# EAGLE design Lab Controller Board v09 (EAGLE 7.5.0)

## Sheet 1 of 2: LED Controller
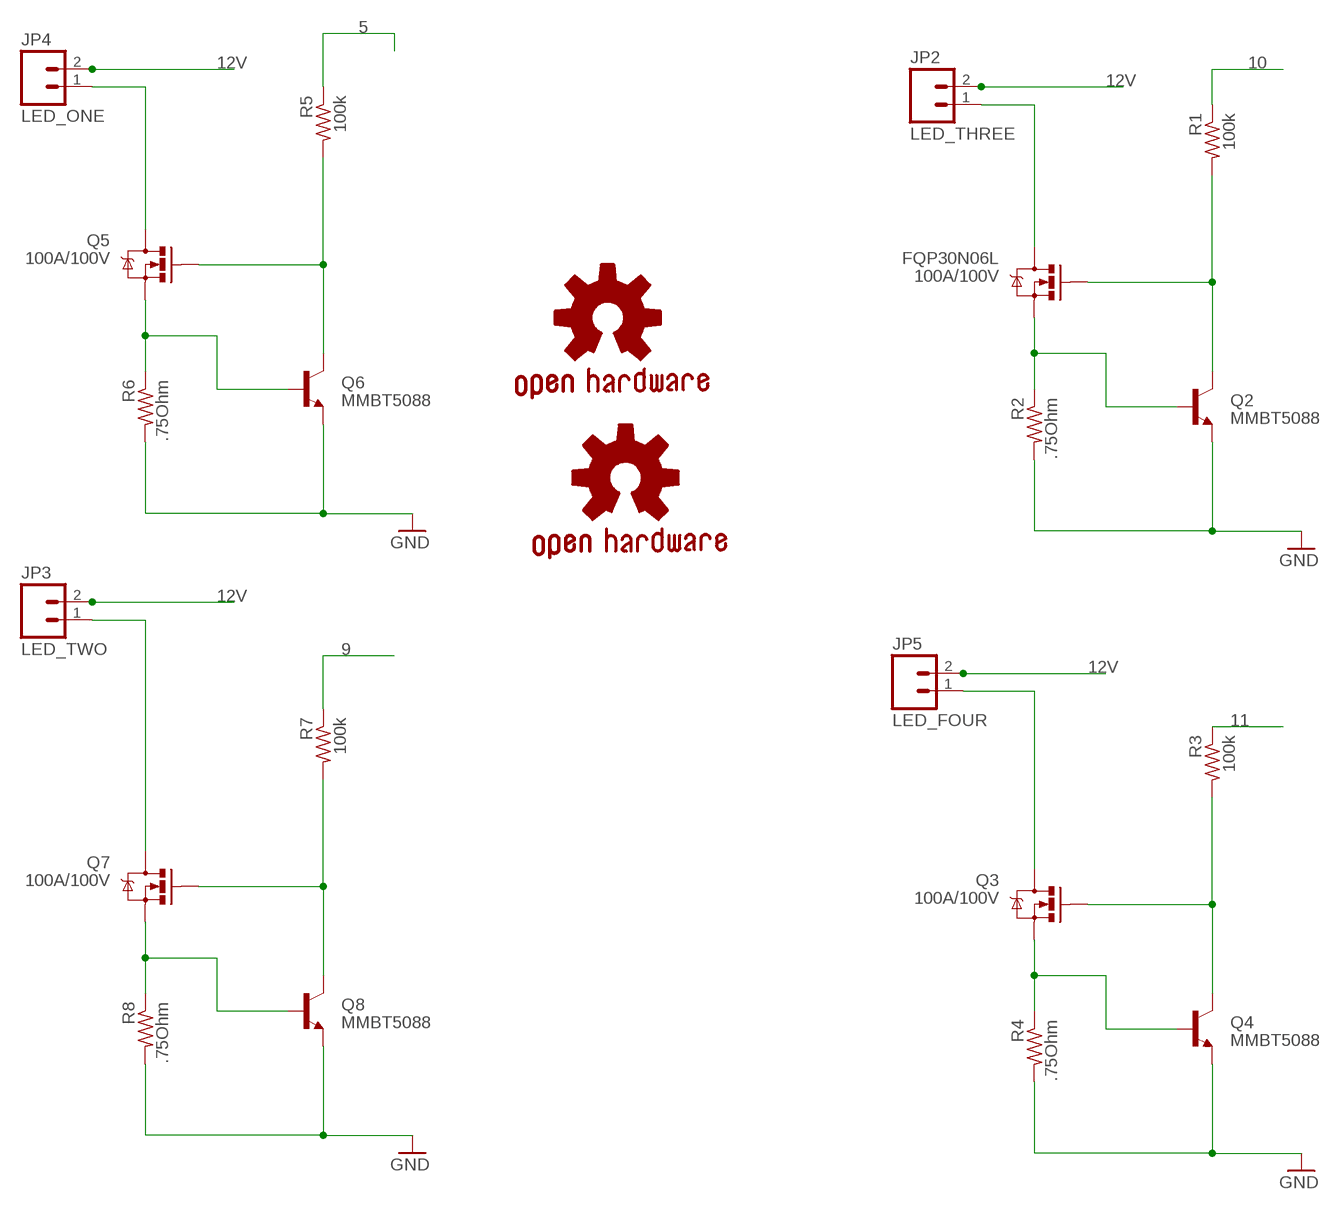
[diagram p0: schematic, sheet 1]

### Parts
FQP30N06L  100A/100V  MOSFET-NCHANNELPSMN7R0  [TO-263/D2PAK]
GOLD_ORB_SM1  OSHWLOGO_GOLD_ORB_MED  [OSHW1]
GOLD_ORB_SM2  OSHWLOGO_GOLD_ORB_SM  [OSHW2]
JP2  LED_THREE  M025MM  [SCREWTERMINAL-5MM-2]
JP3  LED_TWO  M025MM  [SCREWTERMINAL-5MM-2]
JP4  LED_ONE  M025MM  [SCREWTERMINAL-5MM-2]
JP5  LED_FOUR  M025MM  [SCREWTERMINAL-5MM-2]
Q2  MMBT5088  TRANSISTOR_NPNMMBT5088  [SOT23-3]
Q3  100A/100V  MOSFET-NCHANNELPSMN7R0  [TO-263/D2PAK]
Q4  MMBT5088  TRANSISTOR_NPNMMBT5088  [SOT23-3]
Q5  100A/100V  MOSFET-NCHANNELPSMN7R0  [TO-263/D2PAK]
Q6  MMBT5088  TRANSISTOR_NPNMMBT5088  [SOT23-3]
Q7  100A/100V  MOSFET-NCHANNELPSMN7R0  [TO-263/D2PAK]
Q8  MMBT5088  TRANSISTOR_NPNMMBT5088  [SOT23-3]
R1  100k  R-US_R0805W  [R0805W]
R2  .75Ohm  R-US_0411/3V  [0411V]
R3  100k  R-US_R0805W  [R0805W]
R4  .75Ohm  R-US_0411/3V  [0411V]
R5  100k  R-US_R0805W  [R0805W]
R6  .75Ohm  R-US_0411/3V  [0411V]
R7  100k  R-US_R0805W  [R0805W]
R8  .75Ohm  R-US_0411/3V  [0411V]

### Nets
5: R5.1 ; also sheet 2
9: R7.1 ; also sheet 2
10: R1.1 ; also sheet 2
11: R3.1 ; also sheet 2
12V: JP2.2 JP3.2 JP4.2 JP5.2 ; also sheet 2
FET_SOURCE: FQP30N06L.3(S) Q2.1(B) R2.1
FET_SOURCE1: Q3.3(S) Q4.1(B) R4.1
FET_SOURCE2: Q5.3(S) Q6.1(B) R6.1
FET_SOURCE3: Q7.3(S) Q8.1(B) R8.1
GND: Q2.2(E) Q4.2(E) Q6.2(E) Q8.2(E) R2.2 R4.2 R6.2 R8.2 ; also sheet 2
LED_DRAIN: FQP30N06L.2(D) JP2.1
LED_DRAIN1: JP5.1 Q3.2(D)
LED_DRAIN2: JP4.1 Q5.2(D)
LED_DRAIN3: JP3.1 Q7.2(D)
PWM_B: FQP30N06L.1(G) Q2.3(C) R1.2
PWM_B1: Q3.1(G) Q4.3(C) R3.2
PWM_B2: Q5.1(G) Q6.3(C) R5.2
PWM_B3: Q7.1(G) Q8.3(C) R7.2

## Sheet 2 of 2: My Arduino
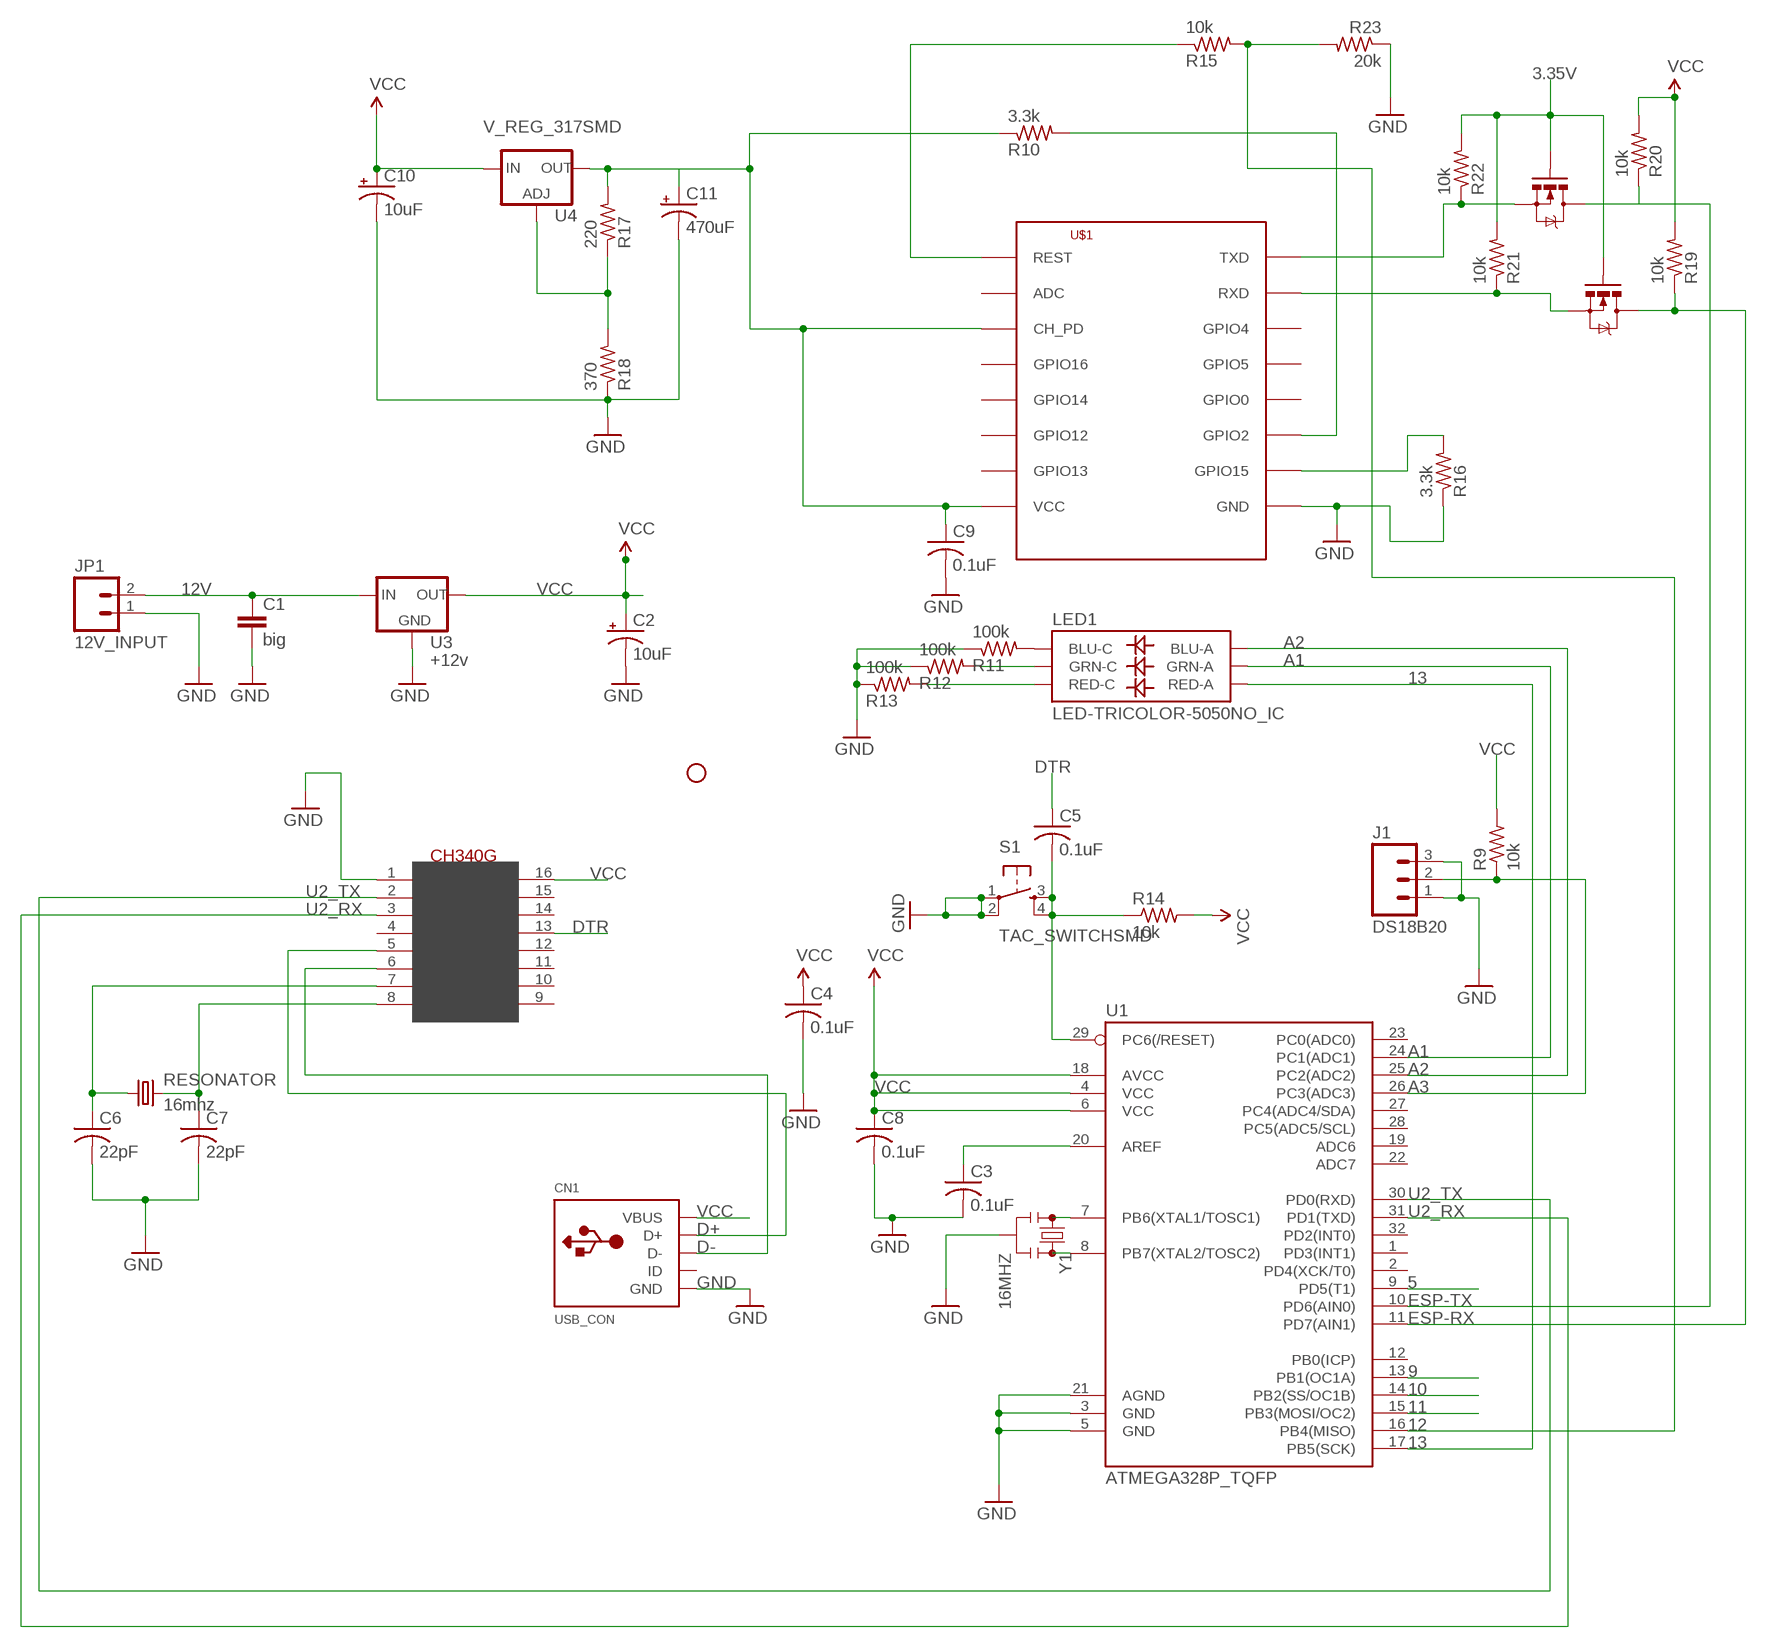
[diagram p1: schematic, sheet 2]

### Parts
C1  big  CAPPTH1  [CAP-PTH-5MM]
C2  10uF  CAP_POL3528  [EIA3528]
C3  0.1uF  C-USC0402  [C0402]
C4  0.1uF  C-USC0805K  [C0805K]
C5  0.1uF  C-USC0805K  [C0805K]
C6  22pF  C-USC0805K  [C0805K]
C7  22pF  C-USC0805K  [C0805K]
C8  0.1uF  C-USC0402  [C0402]
C9  0.1uF  C-USC0805K  [C0805K]
C10  10uF  CAP_POL3528  [EIA3528]
C11  470uF  CPOL-USD/7343-31W  [D/7343-31W]
CN1  USB_CON  USBMINIB  [USB-MINIB]
J1  DS18B20  M03LOCK  [1X03_LOCK]
JP1  12V_INPUT  M025MM  [SCREWTERMINAL-5MM-2]
LED1  LED-TRICOLOR-5050NO_IC  [LED-TRICOLOR-5050]
Q1  MOSFET-NCHANNELAO3404A  [SOT23-3]
Q9  MOSFET-NCHANNELAO3404A  [SOT23-3]
R9  10k  R-US_R0805W  [R0805W]
R10  3.3k  R-US_R0805W  [R0805W]
R11  100k  R-US_R0805W  [R0805W]
R12  100k  R-US_R0805W  [R0805W]
R13  100k  R-US_R0805W  [R0805W]
R14  10k  R-US_R0805W  [R0805W]
R15  10k  R-US_R0805W  [R0805W]
R16  3.3k  R-US_R0805W  [R0805W]
R17  220  R-US_R0805W  [R0805W]
R18  370  R-US_R0805W  [R0805W]
R19  10k  R-US_R0805W  [R0805W]
R20  10k  R-US_R0805W  [R0805W]
R21  10k  R-US_R0805W  [R0805W]
R22  10k  R-US_R0805W  [R0805W]
R23  20k  R-US_R0805W  [R0805W]
RESONATOR  16mhz  CRYSTALHC49UP  [HC49UP]
S1  TAC_SWITCHSMD  [TACTILE-SWITCH-SMD]
STANDOFF1  STAND-OFF  [STAND-OFF]
U1  ATMEGA328P_TQFP  [TQFP32-08]
U2  CH340G  [SOIC16]
U3  +12v  V_REG_78XX7812  [TO-252]
U4  V_REG_317SMD  [SOT223]
U$1  ESP8266-07  [ESP-07]
Y1  16MHZ  RESONATOR16MHZ  [RESONATOR-SMD]

### Nets
3.35V: C9.1 C11.+ Q1.1(G) Q9.1(G) R10.1 R17.2 R21.2 R22.2 U4.2(OUT) U$1.CH_PD U$1.VCC
5: U1.9(PD5(T1)) ; also sheet 1
9: U1.13(PB1(OC1A)) ; also sheet 1
10: U1.14(PB2(SS/OC1B)) ; also sheet 1
11: U1.15(PB3(MOSI/OC2)) ; also sheet 1
12: R15.2 R23.2 U1.16(PB4(MISO))
12V: C1.1 JP1.2 U3.1(IN) ; also sheet 1
13: LED1.2(RED-A) U1.17(PB5(SCK))
A1: LED1.1(GRN-A) U1.24(PC1(ADC1))
A2: LED1.3(BLU-A) U1.25(PC2(ADC2))
A3: J1.2 R9.1 U1.26(PC3(ADC3))
D+: CN1.D+ U2.5(D+)
D-: CN1.D- U2.6(D-)
DTR: C5.1 U2.13(DTR)
ESP-RX: Q9.3(D) R19.1 U1.11(PD7(AIN1))
ESP-TX: Q1.3(D) R20.1 U1.10(PD6(AIN0))
GND: C1.2 C2.C(-) C3.2 C4.2 C6.2 C7.2 C8.2 C9.2 C10.C(-) C11.- CN1.GND J1.1 J1.3 JP1.1 R11.1 R12.1 R13.1 R16.1 R18.1 R23.1 S1.1 S1.2 U1.3(GND) U1.5(GND) U1.21(AGND) U2.1(GND) U3.3(GND) U$1.GND Y1.2 ; also sheet 1
N$1: C3.1 U1.20(AREF)
N$2: U1.7(PB6(XTAL1/TOSC1)) Y1.1
N$3: R15.1 U$1.REST
N$4: R10.2 U$1.GPIO2
N$5: R16.2 U$1.GPIO15
N$6: LED1.4(BLU-C) R11.2
N$8: LED1.6(GRN-C) R12.2
N$9: LED1.5(RED-C) R13.2
N$11: U1.8(PB7(XTAL2/TOSC2)) Y1.3
N$12: Q1.2(S) R22.1 U$1.TXD
N$13: C5.2 R14.1 S1.3 S1.4 U1.29(PC6(/RESET))
N$14: R17.1 R18.2 U4.1(ADJ)
N$15: Q9.2(S) R21.1 U$1.RXD
U2_RX: U1.31(PD1(TXD)) U2.3(RX)
U2_TX: U1.30(PD0(RXD)) U2.2(TX)
VCC: C2.A(+) C4.1 C8.1 C10.A(+) CN1.VBUS R9.2 R14.2 R19.2 R20.2 U1.4(VCC) U1.6(VCC) U1.18(AVCC) U2.16(VCC) U3.2(OUT) U4.3(IN)
X0: C7.1 RESONATOR.2 U2.8(XO)
X1: C6.1 RESONATOR.1 U2.7(XI)
Unconnected: CN1.ID U1.1(PD3(INT1)) U1.2(PD4(XCK/T0)) U1.12(PB0(ICP)) U1.19(ADC6) U1.22(ADC7) U1.23(PC0(ADC0)) U1.27(PC4(ADC4/SDA)) U1.28(PC5(ADC5/SCL)) U1.32(PD2(INT0)) U2.4(V3) U2.9(CTS) U2.10(DSR) U2.11(RI) U2.12(DCD) U2.14(RTS) U2.15(RS232) U$1.ADC U$1.GPIO0 U$1.GPIO4 U$1.GPIO5 U$1.GPIO12 U$1.GPIO13 U$1.GPIO14 U$1.GPIO16

## Library data of the parts
C1 = SparkFun-Passives:CAP: Capacitor Standard 0603 ceramic capacitor, and 0.1" leaded capacitor.
C2 C10 = SparkFun-Capacitors:CAP_POL: Capacitor Polarized These are standard SMD and PTH capacitors. Normally 10uF, 47uF, and 100uF in electrolytic and tantalum varieties. Always verify the external diameter of the through hole cap, it varies with capacity, voltage, and manufacturer. The EIA devices should be standard.
C3-C9 = resistor:C-US: CAPACITOR, American symbol
C11 = resistor:CPOL-US: POLARIZED CAPACITOR, American symbol
CN1 = adafruit:USB: USB Connectors USBMINIB - Surface Mount Female Mini-B USB Connector 4UConnector: 06564 By microbuilder.eu Thru-hole RA Female Mini-B USB Connector 4UConnector: 18732 By ladyada.net
FQP30N06L Q3 Q5 Q7 = SparkFun-DiscreteSemi:MOSFET-NCHANNEL: Common NMOSFET Parts MFG P/N Store ID Prod ID FDD8780 TRANS-09984 SI7820DN TRANS-11055 FDS6630A IC-08089 2N7002PW TRANS-11151 FQP30N06L COM-10213 TRANS-10060 BSS123LT1G TRANS-08345 BSS138 TRANS-00830 BS170 2N7000; PROD_ID: TRANS-12437
GOLD_ORB_SM1 GOLD_ORB_SM2 = bfl:OSHWLOGO: These are Open-Source Hardware logos.
J1 = SparkFun-Connectors:M03: Header 3 Standard 3-pin 0.1" header. Use with straight break away headers (SKU : PRT-00116), right angle break away headers (PRT-00553), swiss pins (PRT-00743), machine pins (PRT-00117), and female headers (PRT-00115). Molex polarized connector foot print use with SKU : PRT-08232 with associated crimp pins and housings.
JP1-JP5 = SparkFun-Connectors:M02: Standard 2-pin 0.1" header. Use with - straight break away headers ( PRT-00116) - right angle break away headers (PRT-00553) - swiss pins (PRT-00743) - machine pins (PRT-00117) - female headers (PRT-00115) Molex polarized connector foot print use with: PRT-08233 with associated crimp pins and housings. 2.54_SCREWTERM for use with PRT-10571. 3.5mm Screw Terminal footprints for PRT-08084 5mm Screw Terminal footprints for use with PRT-08432; STOREFRONT_ID: PRT-08432
LED1 = SparkFun-LED:LED-TRICOLOR-5050
Q1 Q9 = SparkFun-DiscreteSemi:MOSFET-NCHANNEL: Common NMOSFET Parts MFG P/N Store ID Prod ID FDD8780 TRANS-09984 SI7820DN TRANS-11055 FDS6630A IC-08089 2N7002PW TRANS-11151 FQP30N06L COM-10213 TRANS-10060 BSS123LT1G TRANS-08345 BSS138 TRANS-00830 BS170 2N7000; PROD_ID: TRAN-12988
Q2 Q4 Q6 Q8 = SparkFun-DiscreteSemi:TRANSISTOR_NPN: Generic NPN BJT MMBT2222A - TRANS-08049 (SOT-23, 1A 40V) MPSA42 - TRANS-09116 (SOT-23, 500mA 300V) MMBT5088LT1G - TRANS-11160 (SOT-23, 50 mA 30V) BC547 - COM-08928 <http://www.sparkfun.com/products/8928> (TO-92 45V 100mA) (1.Collector 2.Base 3.Emitter) 2N3904 - COM-00521 <http://www.sparkfun.com/products/521> (TO-92 40V 200mA) (1.Emitter 2.Base 3.Collector) P2N2222A - COM-12852 <http://www.sparkfun.com/products/12852> (TO-92 40V 600mA) (1.Collector 2.Base 3.Emitter); PROD_ID: TRANS-11160
R1-R23 = resistor:R-US_: RESISTOR, American symbol
RESONATOR = crystal:CRYSTAL: CRYSTAL; OC_FARNELL: unknown; OC_NEWARK: unknown
S1 = SparkFun-Retired:TAC_SWITCH: Momentary Switch Button commonly used for reset or general input. Spark Fun Electronics SKU : COM-00097 SMT- SWCH-08247; PROD_ID: SWCH-08247
STANDOFF1 = SparkFun-Electromechanical:STAND-OFF: #4 Stand Off This is the mechanical footprint for a #4 phillips button head screw. Use the keepout ring to avoid running the screw head into surrounding components. SKU : PRT-00447
U1 = SparkFun-DigitalIC:ATMEGA328P_TQFP; PROD_ID: IC-09069
U2 = usb-serial:CH340G
U3 = SparkFun-PowerIC:V_REG_78XX: Voltage Regulator Standard 78xx regulator. IGO (Input Ground Output). Spark Fun Electronics SKU : COM-00107; PROD_ID: VREG-12370
U4 = SparkFun-PowerIC:V_REG_317: Voltage Regulator Standard LM317 adjustable voltage regulator. AOI (Adjust Output Input). Google 'LM317 Calculator' for easy to use app to get the two resistor values needed. 240/720 for 5V output. 240/390 for 3.3V output. Spark Fun Electronics SKU : COM-00527
U$1 = lio:ESP8266
Y1 = SparkFun-FreqCtrl:RESONATOR: Resonator Small SMD resonator. Used, eg, on the Arduino Pro/ Pro Mini boards. 8MHz- XTAL-08895 16MHz- XTAL-08900; PROD_ID: XTAL-08900

## Board
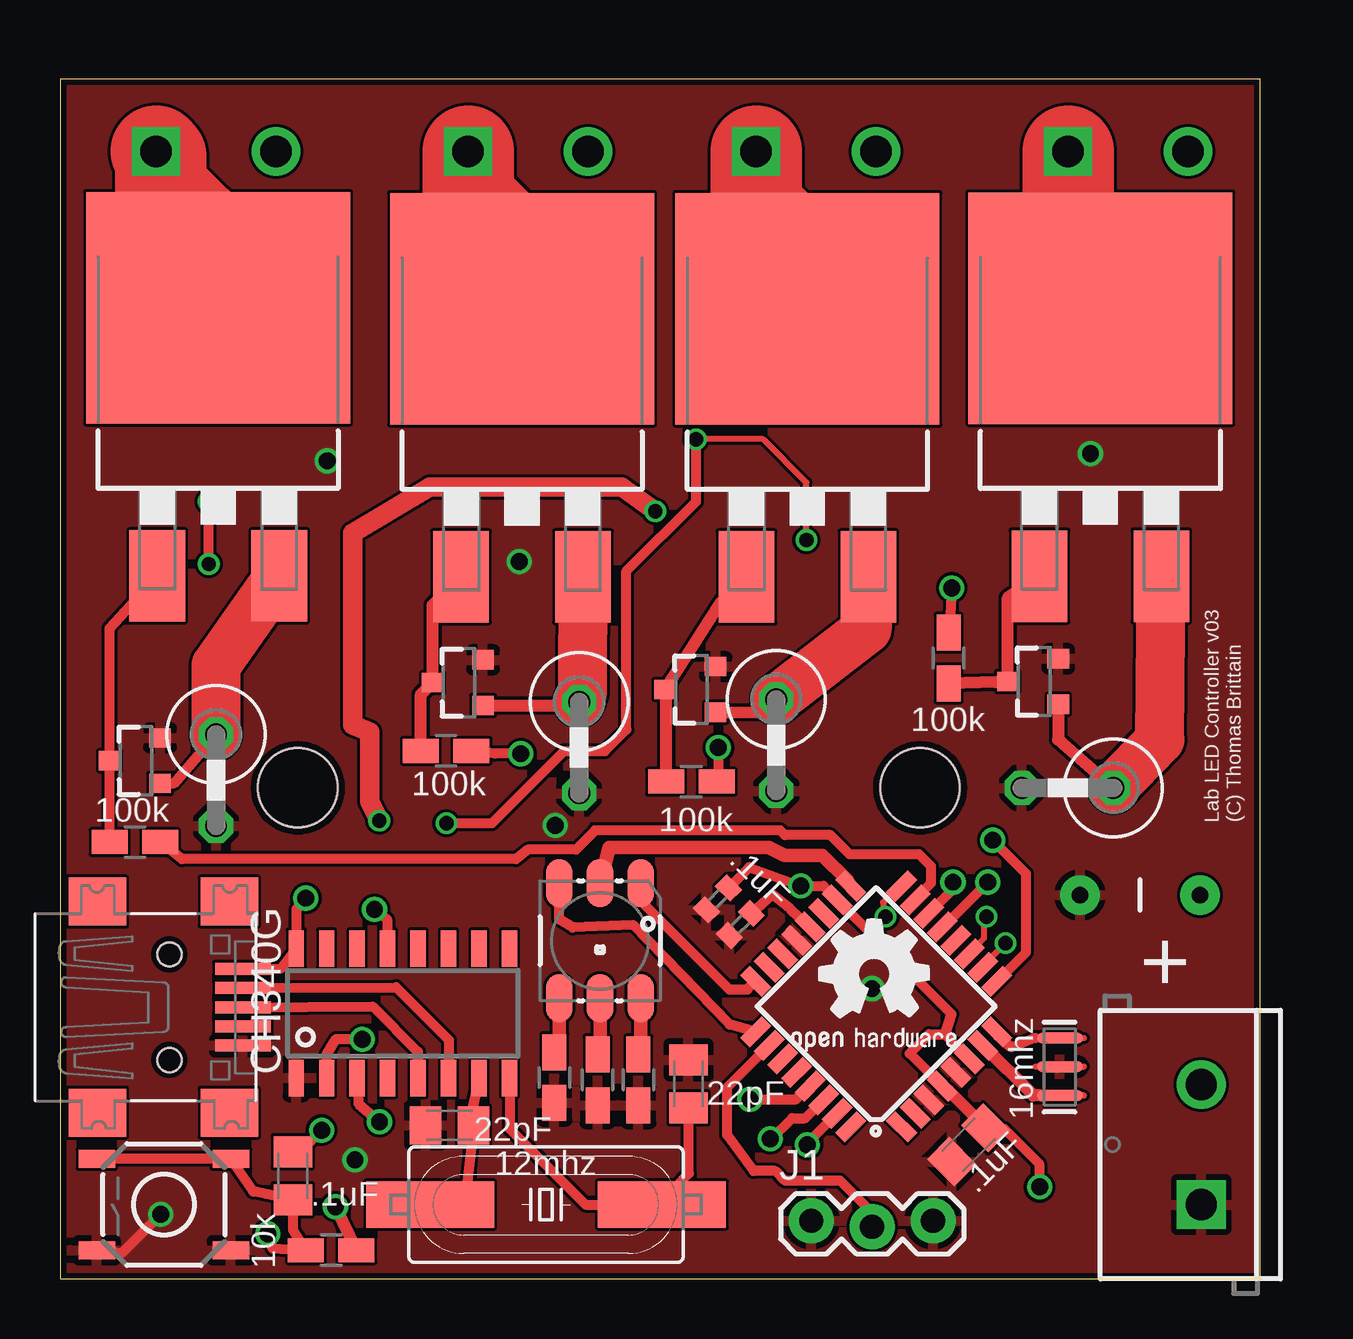
[diagram p2: board, top side]
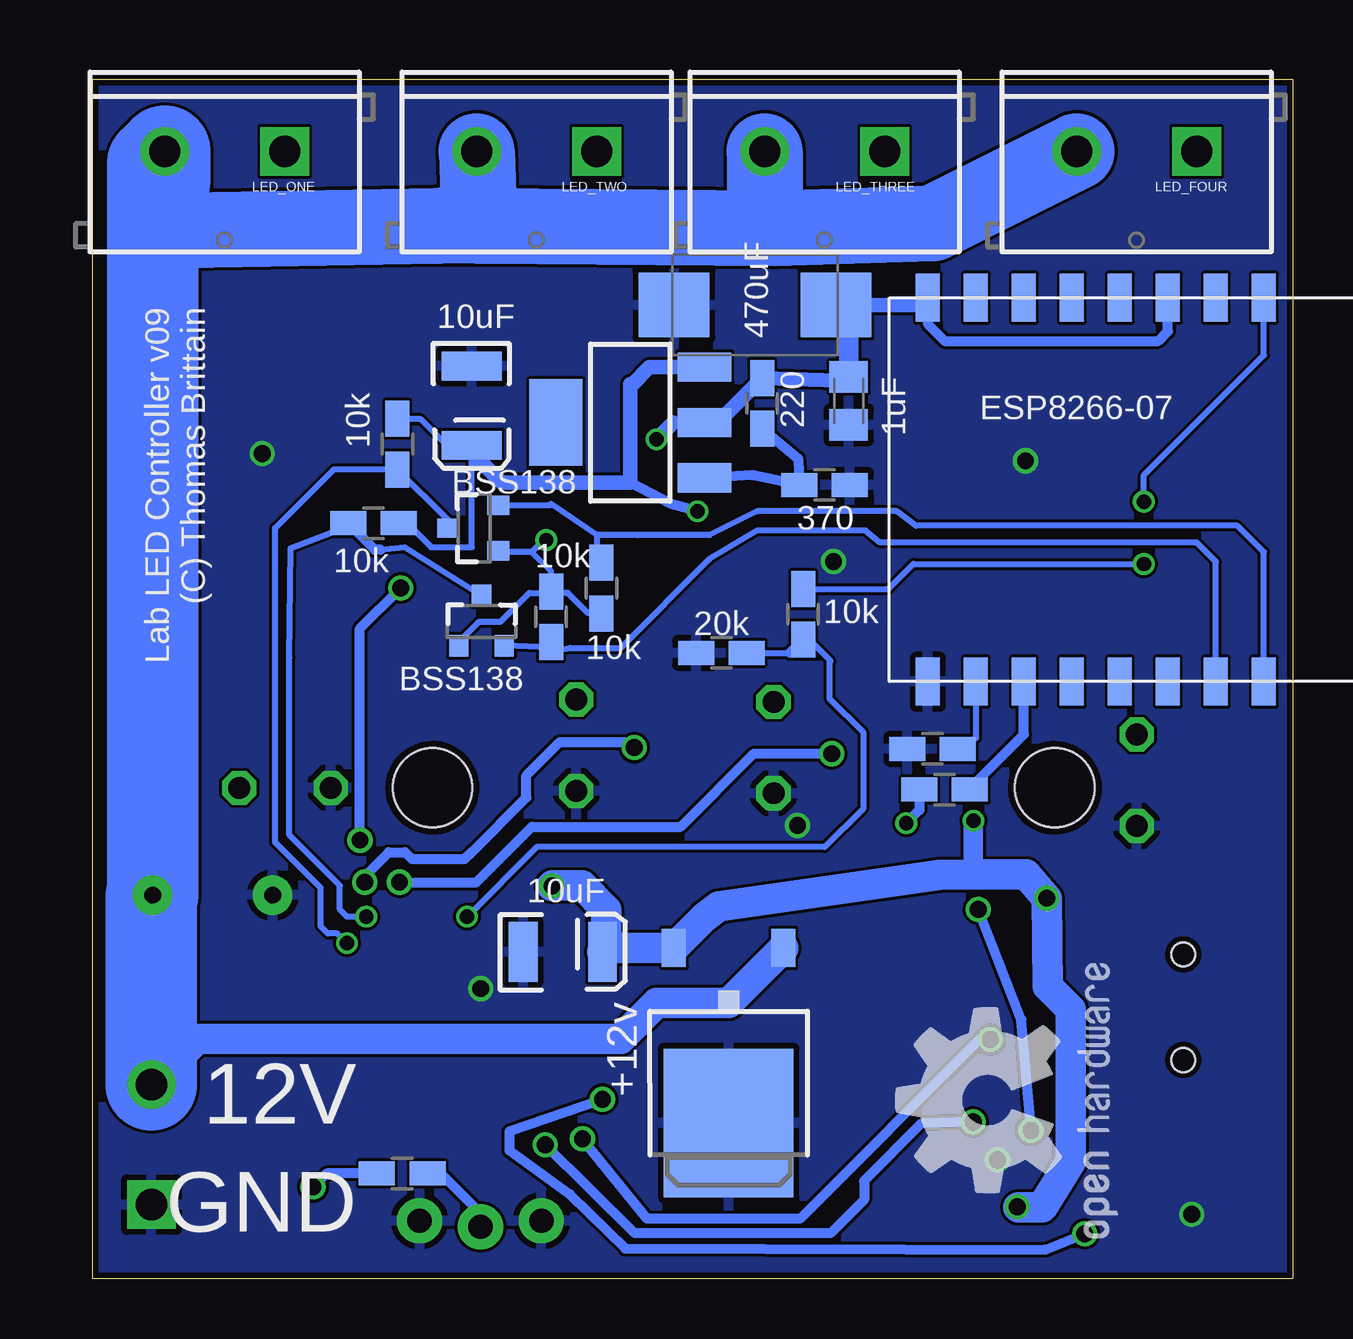
[diagram p3: board, bottom side, seen from below]

Size 50 x 50 mm. Coordinates in mm from the lower left corner, seen from the top.
Outline: 0,0 50,0 50,50 0,50 0,0
Copper layers (1*16): Top 0.035mm / dielectric 1.5mm / Bottom 0.035mm
Design rules "dirt_cheap_dirty_boards.v1 *": minimum track width 5mil, minimum drill 12mil, track to track 5mil, track to pad 5mil, pad to pad 5mil, via to via 5mil, smd to smd 0mil, copper to edge 10mil, drill to drill 10mil, minimum pad ring 10mil, minimum via ring 6mil, stop-mask expansion 2mil, vias tented up to drill 0.7mm, thermal gap 10mil

### Footprints (pad centres in the part's own frame; a part is rotated, then mirrored left to right if it is on the bottom)
CAP-PTH-5MM = drill 0.7 pad 1.651: 1 -2.5,0; 2 2.5,0
EIA3528 = smd 1.2 x 2.5: A 1.65,0; C -1.65,0
C0402 = smd 0.7 x 0.9: 1 -0.65,0; 2 0.65,0
C0805K = smd 1.3 x 1.6: 1 -1,0; 2 1,0
D/7343-31W = smd 2.95 x 2.7: + 3.375,0; - -3.375,0
USB-MINIB = smd 0.5 x 2.308: D+ 0,4.064; D- -0.8,4.064; GND 1.6,4.064; ID 0.8,4.064; VBUS -1.6,4.064 | smd 2 x 2.4: GND1 -4.4,-2; GND2 -4.4,3.5; GND3 4.4,3.5; GND4 4.4,-2 | hole 1: -2.2,1; 2.2,1
TO-263/D2PAK = smd 2.32 x 3.81: 1 -2.54,-7.045; 3 2.54,-7.045 | smd 11 x 9.65: 2 0,4.125
1X03_LOCK = drill 1.016 pad 1.88: 1 0,0.127; 2 2.54,-0.127; 3 5.08,0.127
SCREWTERMINAL-5MM-2 = drill 1.3 pad 2.032 square: 1 0,0 | drill 1.3 pad 2.032: 2 5,0
LED-TRICOLOR-5050 = smd 2 x 1.1: 1 -2.4,1.7; 2 -2.4,0; 3 -2.4,-1.7; 4 2.4,-1.7; 5 2.4,0; 6 2.4,1.7
SOT23-3 = smd 0.8 x 0.9: 1 -0.95,-1; 2 0.95,-1; 3 0,1.1
R0805W = smd 1.5 x 1: 1 -1.052,0; 2 1.052,0
0411V = drill 0.914 octagon: 1 -2.54,0; 2 1.27,0
HC49UP = smd 5.334 x 1.93: 1 -4.826,0; 2 4.826,0
TACTILE-SWITCH-SMD = smd 1.524 x 0.762: 1 -2.794,1.905; 2 2.794,1.905; 3 -2.794,-1.905; 4 2.794,-1.905
STAND-OFF = hole 3.302: 0,0
TQFP32-08 = smd 1.27 x 0.559: 1 -4.293,2.8; 2 -4.293,2; 3 -4.293,1.2; 4 -4.293,0.4; 5 -4.293,-0.4; 6 -4.293,-1.2; 7 -4.293,-2; 8 -4.293,-2.8; 17 4.293,-2.8; 18 4.293,-2; 19 4.293,-1.2; 20 4.293,-0.4; 21 4.293,0.4; 22 4.293,1.2; 23 4.293,2; 24 4.293,2.8 | smd 0.559 x 1.27: 9 -2.8,-4.293; 10 -2,-4.293; 11 -1.2,-4.293; 12 -0.4,-4.293; 13 0.4,-4.293; 14 1.2,-4.293; 15 2,-4.293; 16 2.8,-4.293; 25 2.8,4.293; 26 2,4.293; 27 1.2,4.293; 28 0.4,4.293; 29 -0.4,4.293; 30 -1.2,4.293; 31 -2,4.293; 32 -2.8,4.293
SOIC16 = smd 0.635 x 1.524: 1 -4.445,-2.695; 2 -3.175,-2.695; 3 -1.905,-2.695; 4 -0.635,-2.695; 5 0.635,-2.695; 6 1.905,-2.695; 7 3.175,-2.695; 8 4.445,-2.695; 9 4.445,2.695; 10 3.175,2.695; 11 1.905,2.695; 12 0.635,2.695; 13 -0.635,2.695; 14 -1.905,2.695; 15 -3.175,2.695; 16 -4.445,2.695
TO-252 = smd 1 x 1.6: 1 -2.28,-4.8; 2 2.28,-4.8 | smd 5.4 x 6.2: 3 0,2.5
SOT223 = smd 1.219 x 2.235: 1 -2.311,-3.099; 2 0,-3.099; 3 2.311,-3.099 | smd 3.6 x 2.2: 4 0,3.099
ESP-07 = smd 1 x 2: ADC -1.6,-8; CH_PD 0.4,-8; GND 10.4,8; GPIO0 4.4,8; GPIO2 6.4,8; GPIO4 0.4,8; GPIO5 2.4,8; GPIO12 6.4,-8; GPIO13 8.4,-8; GPIO14 4.4,-8; GPIO15 8.4,8; GPIO16 2.4,-8; REST -3.6,-8; RXD -1.6,8; TXD -3.6,8; VCC 10.4,-8
RESONATOR-SMD = smd 0.45 x 1.905: 1 -1.2,0; 2 0,0; 3 1.2,0

### Placement (x,y rotation side)
C1  45,16 180 top
C2  30.41,13.64 0 bottom
C3  28.35,14.77 225 top
C4  37.86,5.6 225 top
C5  9.7,4.3 270 top
C6  16.23,6.4 180 top
C7  26.19,8.13 90 top
C8  27.4,15.84 225 top
C9  18.5,36.6 270 bottom
C10  34.2,36.4 270 bottom
C11  22.4,40.6 0 bottom
CN1  3.56,11.33 270 top
FQP30N06L  19.25,36.31 0 top
GOLD_ORB_SM1  5.57,1.08 90 bottom
GOLD_ORB_SM2  30.1,8.43 0 top
J1  31.3,2.3 0 top
JP1  47.55,3.1 90 top
JP2  17,47 180 bottom
JP3  29,47 180 bottom
JP4  42,47 180 bottom
JP5  4,47 180 bottom
LED1  22.5,14.1 270 top
Q1  34.1,31.3 90 bottom
Q2  16.62,24.86 90 top
Q3  6.59,36.35 0 top
Q4  3.17,21.6 90 top
Q5  43.35,36.34 0 top
Q6  40.59,24.9 90 top
Q7  31.14,36.31 0 top
Q8  26.32,24.57 90 top
Q9  33.8,27.4 0 bottom
R1  16.08,22.01 180 top
R2  21.63,21.52 270 top
R3  3.12,18.21 180 top
R4  6.5,20.15 270 top
R5  37.03,25.88 270 top
R6  41.35,20.47 180 top
R7  26.3,20.73 180 top
R8  29.84,21.62 270 top
R9  37.1,4.4 180 bottom
R10  14.5,20.4 0 bottom
R11  20.6,8.4 90 top
R12  24.1,8.3 90 top
R13  22.4,8.3 90 top
R14  11.3,1.2 0 top
R15  20.4,27.7 270 bottom
R16  15,22.1 0 bottom
R17  22.1,36.5 90 bottom
R18  19.5,33.1 180 bottom
R19  38.3,31.5 0 bottom
R20  37.3,34.8 90 bottom
R21  30.9,27.6 90 bottom
R22  28.8,28.8 270 bottom
R23  23.8,26.1 0 bottom
RESONATOR  20.25,3.1 0 top
S1  4.33,3.1 180 top
STANDOFF1  35.84,20.47 0 top
STANDOFF2  STAND-OFF  [STAND-OFF]  9.91,20.47 180 top
U1  34.01,11.36 135 top
U2  14.28,11.07 0 top
U3  23.5,9 180 bottom
U4  27.6,35.7 90 bottom
U$1  4.8,32.9 180 bottom
Y1  41.66,8.84 90 top

### Tracks (layer width: path | path; a pad name or v marks a point on that pad's centre or on a via)
3.35V  (via drill 0.6)
  Top 0.254: v31.1,30.8 31.1,33.2 29.3,35 v26.5,35
  Top 0.406: v16.1,19 18,19 21,22 22.7,22 23.6,22.9 23.6,29.5 26.5,32.4 v26.5,35
  Bottom 0.254: Q9.1 34.75,26.55 33.9,27.4 33,27.4 31.8,28.6 30.95,28.6 R21.2 | 33.1,30.2 Q1.1 33.05,30.3 31.7,30.3 | v31.1,30.8 31.2,30.8 31.7,30.3 | R22.2 29.35,27.75 30.2,28.6 30.85,28.6 R21.2 | R21.2 30.9,29.5 31.7,30.3
  Bottom 0.406: U$1.CH_PD 5.2,39.5 5.6,39.1 14.5,39.1 15.2,39.8 U$1.VCC 15.29,40.32 15.56,40.6 | R10.1 15.55,19.55 v16.1,19 | 25.8,35.7 U4.2 23.95,35.7 | 18.9,37.45 C9.1
  Bottom 0.61: 25.8,35.7 v26.5,35 | 23.95,35.7 R17.2 18.9,37.45 | C11.+ 15.56,40.6
  Bottom 0.813: C9.1 18.5,40.08 C11.+
5  (via drill 0.7)
  Top 0.406: U1.9 39.06,12.41 40.26,13.61 40.26,16.89 v38.86,18.29 | v37.16,28.8 37.06,26.96 R5.1
  Bottom 0.406: v38.86,18.29 38.86,27.1 v37.16,28.8
9  (via drill 0.7)
  Top 0.406: U1.13 36.84,14.71 v38.66,16.54 | v27.43,22.15 27.43,20.8 R7.1
  Bottom 0.406: v38.66,16.54 38.58,16.87 37.67,17.78 36.98,17.78 36.7,17.5 34.5,17.5 34.21,17.78 31.93,20.07 31.93,20.98 30.53,22.38 27.66,22.38 v27.43,22.15
10  (via drill 0.7)
  Top 0.406: U1.14 37.23,16.28 v37.21,16.54 | v19.2,21.89 18.12,21.89 R1.1
  Bottom 0.406: v37.21,16.54 34.01,16.54 31.7,18.85 25.5,18.85 22.45,21.89 v19.2,21.89
11
  Top 0.406: U1.15 35.63,15.83 36.3,16.5 36.3,17.2 35.8,17.7 32.9,17.7 32.1,18.5 30.2,18.5 30,18.7 22.3,18.7 21.5,17.9 19.5,17.9 19,17.5 5.08,17.5 R3.1
12  (via drill 0.6)
  Top 0.254: U1.16 34.96,16.36 34.3,15.7 34.3,15.2 v34.4,15.1
  Bottom 0.254: v34.4,15.1 31.5,18 19.5,18 17.9,19.6 17.9,22.8 19.3,24.2 19.3,25.7 19.25,25.75 20.15,26.65 | R23.2 20.95,26.1
  Bottom 0.406: 20.15,26.65 R15.2 20.95,26.1
12V
  Bottom 1.27: U3.1 21.22,13.78 23.5,11.5 26.5,11.5 28,10 45.65,10 JP1.2
  Bottom 1.422: JP1.2 46.49,9.45
  Bottom 2.54: 22,44.7 21.6,43.8
  Bottom 3.175: 47.3,43.7 35.6,43.9 33.9,43.9 | 33.9,43.9 21.6,43.8 15,44 JP5.2 | JP2.2 22,44.7 | JP3.2 33.9,43.9
  Bottom 3.81: JP1.2 47.55,15.95 C1.1 47.5,46.5 JP4.2 47,45.8 47.3,43.7
13
  Top 0.559: U1.17 32.8,16.63 31.75,17.65 30.2,17.65 29.54,17.98 22.89,17.98 LED1.2
A1
  Top 0.406: LED1.1 24.2,15.75 27.89,12.06 28.64,12.06 U1.24
A2
  Top 0.406: U1.25 27.9,10.6 23.88,14.75 21.36,14.65 20.8,14.99 LED1.3
A3
  Top 0.254: 34.15,1.88 J1.2
  Top 0.406: J1.2 33.94,2.66 32.5,4.1 30.2,4.1 29.8,4.5 28.9,4.5 27.8,6 27.8,7.98 U1.26
  Bottom 0.254: 33.8,1.81 J1.2
  Bottom 0.406: R9.1 35.5,4.4 33.85,2.75 33.85,1.76 J1.2
D+
  Top 0.406: CN1.D+ 13.03,11.35 14.91,9.47 U2.5
D-
  Top 0.406: CN1.D- 14.01,12.15 16.2,9.96 16.2,8.39 U2.6
DTR  (via drill 0.7 pad 0.25)
  Top 0.406: C5.1 9.7,5 v10.9,6.2 | v13.1,15.4 13.63,15 U2.13
  Bottom 0.406: v10.9,6.2 11.3,10.8 v13.1,15.4
ESP-RX  (via drill 0.6)
  Top 0.254: U1.11 37.89,13.59 38.5,14.2 38.5,15 v38.6,15.1
  Bottom 0.254: v38.6,15.1 39.4,15.1 39.7,15.4 39.7,16.4 41.8,18.5 41.8,25.9 41.75,30.45 39.35,31.35 R19.1 | 38,30.4 37,30.5 Q9.3
  Bottom 0.406: 38,30.4 38.25,30.4 R19.1
ESP-TX  (via drill 0.6)
  Top 0.254: U1.10 38.46,13.06 v39.4,14
  Bottom 0.254: v39.4,14 39.8,14.4 40.2,14.4 40.5,14.7 40.5,16.3 42.4,18.2 42.4,31.3 39.95,33.75 R20.1 35.2,31.65 Q1.3
FET_SOURCE
  Top 0.508: Q2.1 21.33,23.91 R2.1
  Top 2.032: FQP30N06L.3 21.77,24.45 R2.1
FET_SOURCE1
  Top 0.406: Q4.1 4.76,20.65 R4.1
  Top 2.032: R4.1 6.5,25.58 Q3.3
FET_SOURCE2
  Top 0.508: Q6.1 41.59,22.48 R6.1
  Top 2.032: R6.1 45.82,22.47 Q5.3
FET_SOURCE3
  Top 0.508: Q8.1 29.44,23.62 R8.1
  Top 2.032: Q7.3 33.63,27.09 R8.1
GND  (via drill 0.7, 0.7 pad 0.25)
  Top 0.406: S1.2 2.6,1.09 v4.2,2.7
  other vias: 12.3,4.97 20.63,18.9 33.83,12.1 11.13,34.1 42.93,34.4 19.13,29.9
  pour Bottom: -1,51 51,51 51,-2 -1,-2
  pour Top: -1,51 51,51 51,-2 -1,-2
LED_DRAIN
  Top 3.81: FQP30N06L.2 19.25,42.86 17,45.11 JP2.1
LED_DRAIN1
  Top 3.81: Q3.2 7,42.71 4.2,45.51 4.2,46.8 JP5.1
LED_DRAIN2
  Top 3.81: Q5.2 43.35,42.56 42,43.91 JP4.1
LED_DRAIN3
  Top 3.81: Q7.2 31.45,42.26 29,44.71 JP3.1
N$1
  Top 0.406: U1.20 31.23,14.68 30.43,15.42 29.68,16.02 C3.1
N$2
  Top 0.406: U1.7 | 40.87,7.64 Y1.1
  Top 0.508: 40.87,7.64 40.55,7.64 U1.7
N$3  (via drill 0.6)
  Top 0.406: v6.2,29.8 v6.2,32.4
  Bottom 0.254: R15.1 16.85,28.75 15.8,29.8 v6.2,29.8 | v6.2,32.4 6.2,33.5 1.2,38.5 U$1.REST
N$4
  Bottom 0.406: R10.2 13.45,20.45 11.2,22.7 U$1.GPIO2
N$5
  Bottom 0.254: U$1.GPIO15 13.2,22.55 R16.2
N$6
  Top 0.559: LED1.4 20.8,9.45 R11.2
N$8
  Top 0.559: LED1.6 24.2,9.45 R12.2
N$9
  Top 0.559: LED1.5 22.5,9.45 R13.2
N$11
  Top 0.406: U1.8 39.02,10.18 39.64,9.66 40.59,10.04 40.64,10.04
N$12
  Bottom 0.254: U$1.TXD 1.2,30.3 2.3,31.4 15.7,31.4 16.5,32 22.3,32 24.3,31 27.3,31 29,31 | 29,31 30.9,32.3 30.95,32.25 Q1.2 | 29,31 29,30.05 R22.1
N$13  (via drill 0.7)
  Top 0.406: S1.4 S1.3 8.05,3.65 C5.2 9.7,2.05 R14.1 8.85,1.27 v8.66,1.88 | 31.36,8.04 U1.29 30.68,7.49 v28.75,7.49
  Bottom 0.406: v28.75,7.49 32.64,6.15 32.64,5.36 30.11,3.53 27.82,1.27 10.31,1.22 v8.66,1.88
N$14
  Bottom 0.406: R17.1 20.6,34.2 20.6,34.15 R18.2 22.51,33.5 U4.1
N$15
  Bottom 0.254: U$1.RXD 3.2,29.9 4,30.7 17.2,30.7 17.8,31.2 22.3,31.2 24.3,30 28,26.3 30.1,26.3 30.55,26.25 R21.1 31.4,26.35 Q9.2 32.85,26.55
PWM_B
  Top 0.508: R1.2 15.03,24.36 Q2.3 15.52,28.08 FQP30N06L.1
PWM_B1
  Top 0.406: R3.2 Q4.3 2.07,27.12 Q3.1
  Top 0.508: Q3.1 4.46,28.23
PWM_B2
  Top 0.508: Q5.1 39.49,28.4 Q6.3 39.01,24.88 R5.2
PWM_B3
  Top 0.508: Q7.1 27.53,28.19 Q8.3 25.25,24.54 R7.2
U2_RX  (via drill 0.7)
  Top 0.406: U2.3 12.43,7.31 v13.31,6.55 | v31.14,5.59 31.14,5.66 U1.31
  Bottom 0.406: v13.31,6.55 15.47,6.48 17.86,4.09 17.86,3.3 19.25,1.91 27.41,1.91 v31.14,5.59
U2_TX  (via drill 0.7)
  Top 0.406: U2.2 11.11,9.36 11.51,10.01 12.12,10.01 v12.6,9.98 | v29.59,5.84 29.64,5.84 30.5,6.71 31.05,6.71 U1.30
  Bottom 0.406: v12.6,9.98 13.06,9.98 20.52,2.52 26.9,2.52 v29.59,5.84
VCC  (via drill 0.6, 0.7)
  Top 0.406: U1.4 35.4,9.4 36.2,10.2 36.86,10.2 | 36.86,10.2 U1.6 | 36.86,10.2 37.14,11.04 U1.18 31.81,16.38 v30.86,16.38 28.71,17.16 C8.1 | v10.25,15.87 9.85,15.4 U2.16 9.22,12.95 CN1.VBUS | 38.7,6.26 39.34,6.26 40.8,4.8 40.8,3.85 v40.82,3.83
  Top 0.508: U1.4 37.07,7.8 C4.1 38.7,6.26 | v11.48,3 R14.2
  Top 0.813: v13.3,19.1 12.9,19.9 12.9,22.8 12.2,23.1 12.2,31.1 15.4,33 23.4,33 v24.8,32
  Bottom 0.254: R19.2 36.9,31.5 35.9,30.5 34.2,30.5 C10.A | R20.2 36.35,35.85 35.25,34.75 C10.A | C10.A 34.2,34.45
  Bottom 0.406: 11.43,3 v11.48,3 | v24.8,32 25.9,32.3 27.6,33.2 | 24.69,37.9 U4.3 | 24.5,37.9 U4.3 | 24.51,38 U4.3 | 27.6,37.3 27.5,37.3 | R9.2 40.25,4.4 v40.82,3.83
  Bottom 0.508: 13.3,17.05 13,16.86
  Bottom 0.61: 27.6,37.3 27.6,33.2 32.95,33.2 34.2,34.45 | 24.51,38 26.8,38 27.5,37.3
  Bottom 0.813: v13.3,19.1 13.3,17.05
  Bottom 1.27: 11.43,3 10.44,3 9.25,4.9 9.25,11.25 10.2,12.2 v10.25,15.87 11.11,16.86 13,16.86 14.73,16.84 23.91,15.52 24.51,15.07 U3.2 28.59,13.8 | 28.59,13.8 C2.A | 28.59,13.8 28.59,15.39 29.6,16.4 30.84,16.4 v30.86,16.38
X0
  Top 0.406: U2.8 18.75,6.75 18.75,6.25 21.9,3.1 RESONATOR.2 25.63,3.22 25.63,3.83 26.2,4.4 26.2,7.12 C7.1
X1
  Top 0.406: U2.7 16.88,5.83 C6.1 16.85,2.97 RESONATOR.1

### Text on the board
tNames: 100k | 100k | 100k | 100k | Lab LED Controller v03 / (C) Thomas Brittain | .1uF | + | 22pF | 16mhz | 22pF | 12mhz | .1uF | 10k | .1uF
_bsilk: 470uF | Lab LED Controller v09 / (C) Thomas Brittain | 10uF | 220 | 10k | ESP8266-07 | 1uF | BSS138 | 370 | 10k | 10k | 10k | 20k | 10k | BSS138 | 10uF | 12V | GND